# Altium schematic sheet VUE_PIC32_v1_0.SchDoc: [VUE32 - Main]
size A4; Engineer: JFDuval; Revision: 1.0
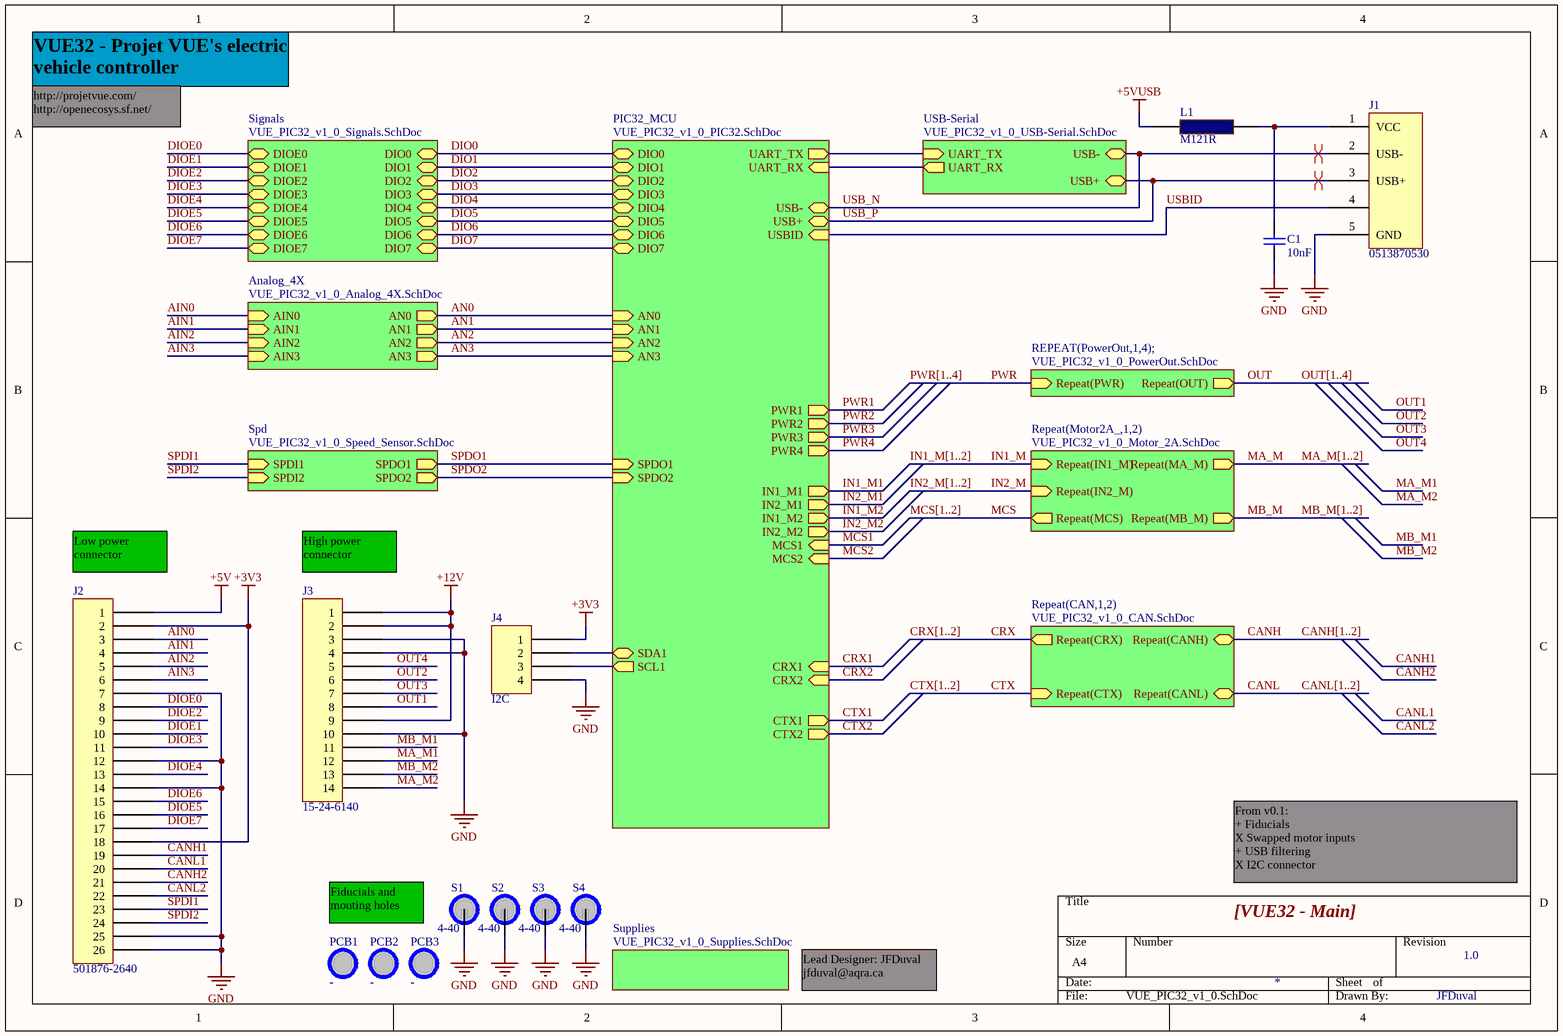
[diagram p0: VUE_PIC32_v1_0.SchDoc]

## Parts
C1  10nF  [0402C]
J1  0513870530  [USB-MINI-B_MOLEX]
J2  501876-2640  [MOLEX_IGRID_26POS_RA]
J3  15-24-6140  [MINI-FIT_RA_14POS]
J4  I2C  [PINS_4POS_1_27MM]
L1  M121R  [0603]
PCB1  -  [FIDUCIAL]  (no BOM)
PCB2  -  [FIDUCIAL]  (no BOM)
PCB3  -  [FIDUCIAL]  (no BOM)
S1  4-40  [SCREW_4_40]
S2  4-40  [SCREW_4_40]
S3  4-40  [SCREW_4_40]
S4  4-40  [SCREW_4_40]

## Sub-sheets
Analog_4X = VUE_PIC32_v1_0_Analog_4X.SchDoc: AIN0 (in), AN0 (out), AIN2 (in), AN2 (out), AIN1 (in), AN1 (out), AIN3 (in), AN3 (out)
PIC32_MCU = VUE_PIC32_v1_0_PIC32.SchDoc: UART_TX (out), UART_RX (in), CRX1 (in), CTX1 (out), CRX2 (in), CTX2 (out), PWR2 (out), PWR1 (out), DIO0 (bidir), DIO1 (bidir), DIO2 (bidir), DIO3 (bidir), DIO4 (bidir), DIO5 (bidir), DIO6 (bidir), DIO7 (bidir), AN0 (in), AN1 (in), AN2 (in), AN3 (in), SDA1 (bidir), SCL1 (out), SPDO1 (in), USB- (bidir), USB+ (bidir), USBID (in), PWR3 (out), PWR4 (out), IN1_M1 (out), MCS1 (in), MCS2 (in), IN2_M1 (out), IN1_M2 (out), IN2_M2 (out), SPDO2 (in)
Repeat(CAN,1,2) = VUE_PIC32_v1_0_CAN.SchDoc: Repeat(CRX) (out), Repeat(CTX) (in), Repeat(CANH) (bidir), Repeat(CANL) (bidir)
Repeat(Motor2A_,1,2) = VUE_PIC32_v1_0_Motor_2A.SchDoc: Repeat(MCS) (out), Repeat(MA_M) (out), Repeat(MB_M) (out), Repeat(IN1_M) (in), Repeat(IN2_M) (in)
REPEAT(PowerOut,1,4); = VUE_PIC32_v1_0_PowerOut.SchDoc: Repeat(OUT) (out), Repeat(PWR) (in)
Signals = VUE_PIC32_v1_0_Signals.SchDoc: DIO0 (bidir), DIO1 (bidir), DIO2 (bidir), DIO3 (bidir), DIO4 (bidir), DIO5 (bidir), DIO6 (bidir), DIO7 (bidir), DIOE0 (bidir), DIOE1 (bidir), DIOE2 (bidir), DIOE3 (bidir), DIOE4 (bidir), DIOE5 (bidir), DIOE6 (bidir), DIOE7 (bidir)
Spd = VUE_PIC32_v1_0_Speed_Sensor.SchDoc: SPDI1 (in), SPDO1 (out), SPDI2 (in), SPDO2 (out)
Supplies = VUE_PIC32_v1_0_Supplies.SchDoc: no entries
USB-Serial = VUE_PIC32_v1_0_USB-Serial.SchDoc: UART_TX (in), UART_RX (out), USB- (bidir), USB+ (bidir)

## Nets
+3V3: J2.2 J2.18 J4.1
+5V: J2.1
+5VUSB: L1.1
+12V: J3.1 J3.2 J3.9
GND: C1.1 J1.5(GND) J2.7 J2.12 J2.14 J2.25 J2.26 J3.3 J3.4 J3.10 J4.4 S1.0 S2.0 S3.0 S4.0
AIN0: J2.3 ; sheet Analog_4X/AIN0
AIN1: J2.4 ; sheet Analog_4X/AIN1
AIN2: J2.5 ; sheet Analog_4X/AIN2
AIN3: J2.6 ; sheet Analog_4X/AIN3
AN0: sheet PIC32_MCU/AN0, sheet Analog_4X/AN0
AN1: sheet PIC32_MCU/AN1, sheet Analog_4X/AN1
AN2: sheet PIC32_MCU/AN2, sheet Analog_4X/AN2
AN3: sheet PIC32_MCU/AN3, sheet Analog_4X/AN3
CANH: sheet Repeat(CAN,1,2)/Repeat(CANH)
CANH1: J2.19
CANH2: J2.21
CANL: sheet Repeat(CAN,1,2)/Repeat(CANL)
CANL1: J2.20
CANL2: J2.22
CRX: sheet Repeat(CAN,1,2)/Repeat(CRX)
CRX1: sheet PIC32_MCU/CRX1
CRX2: sheet PIC32_MCU/CRX2
CTX: sheet Repeat(CAN,1,2)/Repeat(CTX)
CTX1: sheet PIC32_MCU/CTX1
CTX2: sheet PIC32_MCU/CTX2
DIO0: sheet PIC32_MCU/DIO0, sheet Signals/DIO0
DIO1: sheet PIC32_MCU/DIO1, sheet Signals/DIO1
DIO2: sheet PIC32_MCU/DIO2, sheet Signals/DIO2
DIO3: sheet PIC32_MCU/DIO3, sheet Signals/DIO3
DIO4: sheet PIC32_MCU/DIO4, sheet Signals/DIO4
DIO5: sheet PIC32_MCU/DIO5, sheet Signals/DIO5
DIO6: sheet PIC32_MCU/DIO6, sheet Signals/DIO6
DIO7: sheet PIC32_MCU/DIO7, sheet Signals/DIO7
DIOE0: J2.8 ; sheet Signals/DIOE0
DIOE1: J2.10 ; sheet Signals/DIOE1
DIOE2: J2.9 ; sheet Signals/DIOE2
DIOE3: J2.11 ; sheet Signals/DIOE3
DIOE4: J2.13 ; sheet Signals/DIOE4
DIOE5: J2.16 ; sheet Signals/DIOE5
DIOE6: J2.15 ; sheet Signals/DIOE6
DIOE7: J2.17 ; sheet Signals/DIOE7
IN1_M: sheet Repeat(Motor2A_,1,2)/Repeat(IN1_M)
IN1_M1: sheet PIC32_MCU/IN1_M1
IN1_M2: sheet PIC32_MCU/IN1_M2
IN2_M: sheet Repeat(Motor2A_,1,2)/Repeat(IN2_M)
IN2_M1: sheet PIC32_MCU/IN2_M1
IN2_M2: sheet PIC32_MCU/IN2_M2
MA_M: sheet Repeat(Motor2A_,1,2)/Repeat(MA_M)
MA_M1: J3.12
MA_M2: J3.14
MB_M: sheet Repeat(Motor2A_,1,2)/Repeat(MB_M)
MB_M1: J3.11
MB_M2: J3.13
MCS: sheet Repeat(Motor2A_,1,2)/Repeat(MCS)
MCS1: sheet PIC32_MCU/MCS1
MCS2: sheet PIC32_MCU/MCS2
OUT: sheet REPEAT(PowerOut,1,4);/Repeat(OUT)
OUT1: J3.8
OUT2: J3.6
OUT3: J3.7
OUT4: J3.5
PWR: sheet REPEAT(PowerOut,1,4);/Repeat(PWR)
PWR1: sheet PIC32_MCU/PWR1
PWR2: sheet PIC32_MCU/PWR2
PWR3: sheet PIC32_MCU/PWR3
PWR4: sheet PIC32_MCU/PWR4
SPDI1: J2.23 ; sheet Spd/SPDI1
SPDI2: J2.24 ; sheet Spd/SPDI2
SPDO1: sheet PIC32_MCU/SPDO1, sheet Spd/SPDO1
SPDO2: sheet PIC32_MCU/SPDO2, sheet Spd/SPDO2
USB_N: J1.2(USB-) ; sheet PIC32_MCU/USB-, sheet USB-Serial/USB-
USB_P: J1.3(USB+) ; sheet PIC32_MCU/USB+, sheet USB-Serial/USB+
USBID: J1.4 ; sheet PIC32_MCU/USBID
NetC1_2: C1.2 J1.1(VCC) L1.2
NetJ4_2: J4.2 ; sheet PIC32_MCU/SDA1
NetJ4_3: J4.3 ; sheet PIC32_MCU/SCL1
(unnamed): sheet PIC32_MCU/UART_TX, sheet USB-Serial/UART_TX
(unnamed): sheet PIC32_MCU/UART_RX, sheet USB-Serial/UART_RX

## Buses and harness runs
bus CANH[1..2]
bus CANL[1..2]
bus CRX[1..2]
bus CTX[1..2]
bus IN1_M[1..2]
bus IN2_M[1..2]
bus MA_M[1..2]
bus MB_M[1..2]
bus MCS[1..2]
bus OUT[1..4]
bus PWR[1..4]

## Layout directives
differential pair: USB_N, USB_P

## Notes on the sheet
- VUE32 - Projet VUE's electric vehicle controller
- http://projetvue.com/
  http://openecosys.sf.net/
  + USB filtering
- (near J2) Low power connector
- (near J3) High power connector
- Fiducials and mouting holes
- From v0.1:
  + Fiducials
  X Swapped motor inputs
  + USB filtering
  X I2C connector
- Lead Designer: JFDuval
  jfduval@aqra.ca
  + USB filtering

## Library data of the parts
C1 = CAP_TDK_C_0402_10nF_25V: CAP CER 10000PF 25V 10% X7R 0402; MfgPartNumber: C1005X7R1E103K; Mfg: TDK; Digikey: 445-1260-1-ND; Value: 10nF
J1 = CON_MOLEX_0513870530_USB_MINI_B: CONN RCPT MINIUSB B 5POS SMD R/A; Mfg: Molex Inc; MfgPartNumber: 0513870530; Value: 0513870530; Digikey: WM3756CT-ND
J2 = CON_MOLEX_IGRID_26POS_RA: CONN HEADER 26POS 2MM R/A TIN; Mfg: Molex Connector Corporation; MfgPartNumber: 501876-2640; Value: 501876-2640; Digikey: WM6091-ND
J3 = CON_MOLEX_MINI_FIT_JR_BMI_14POS_RA: CONN HEADER 14POS 4.2MM R/A TIN; Mfg: Molex Connector Corporation; MfgPartNumber: 15-24-6140; Value: 15-24-6140; Digikey: WM17803-ND
J4 = CON_NULL_4POS_1_27MM: 4 Holes 1.27mm; Value: H2x2; Mfg: -; MfgPartNumber: -; Digikey: -
L1 = FERRITE_LAIRD_MI0603M121R-10_0603_2_5A: FERRITE CHIP 2.5A 120 OHM SMD; Mfg: Laird-Signal Integrity Products; MfgPartNumber: MI0603M121R-10; Value: M121R; Digikey: 240-2375-1-ND
PCB1-PCB3 = FIDUCIAL_500UM: Fiducial; Mfg: -; MfgPartNumber: -; Value: -; Digikey: -
S1-S4 = SCREW_4_40: Mfg: -; MfgPartNumber: -; Value: 4-40; Digikey: -